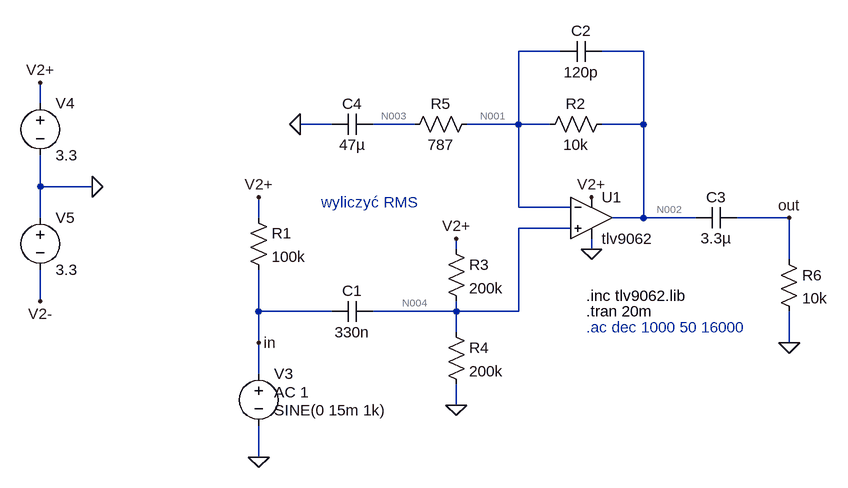
[diagram p0: schematic microphone_ampilier.asc]
microphone_ampilier.asc, the LTspice schematic file:
Version 4.1
SHEET 1 1596 680
WIRE 368 -16 304 -16
WIRE 496 -16 432 -16
WIRE -432 64 -432 32
WIRE 16 96 -32 96
WIRE 144 96 80 96
WIRE 304 96 304 -16
WIRE 304 96 224 96
WIRE 352 96 304 96
WIRE 496 96 496 -16
WIRE 496 96 432 96
WIRE -432 192 -432 144
WIRE -352 192 -432 192
WIRE 304 224 304 96
WIRE 384 224 304 224
WIRE -432 240 -432 192
WIRE -96 240 -96 208
WIRE 496 240 496 96
WIRE 496 240 448 240
WIRE 576 240 496 240
WIRE 720 240 640 240
WIRE 384 256 304 256
WIRE 208 288 208 272
WIRE 416 288 416 272
WIRE 720 304 720 240
WIRE -432 368 -432 320
WIRE -96 384 -96 320
WIRE 16 384 -96 384
WIRE 208 384 208 368
WIRE 208 384 80 384
WIRE 304 384 304 256
WIRE 304 384 208 384
WIRE 208 416 208 384
WIRE -96 432 -96 384
WIRE 720 432 720 384
WIRE -96 480 -96 432
WIRE 208 528 208 496
WIRE -96 608 -96 560
FLAG -96 608 0
FLAG -96 208 V2+
FLAG -352 192 0
FLAG -432 32 V2+
FLAG -432 368 V2-
FLAG 208 272 V2+
FLAG 208 528 0
FLAG 720 240 out
FLAG -96 432 in
FLAG -32 96 0
FLAG 416 208 V2+
FLAG 416 288 0
FLAG 720 432 0
SYMBOL OpAmps\\opamp2 416 176 R0
SYMATTR InstName U1
SYMATTR Value tlv9062
SYMBOL voltage -96 464 R0
WINDOW 123 24 44 Left 2
WINDOW 39 0 0 Left 0
WINDOW 3 24 72 Left 2
SYMATTR Value2 AC 1
SYMATTR InstName V3
SYMATTR Value SINE(0 15m 1k)
SYMBOL res -112 224 R0
SYMATTR InstName R1
SYMATTR Value 100k
SYMBOL cap 80 368 R90
WINDOW 0 0 32 VBottom 2
WINDOW 3 32 32 VTop 2
SYMATTR InstName C1
SYMATTR Value 330n
SYMBOL res 448 80 R90
WINDOW 0 0 56 VBottom 2
WINDOW 3 32 56 VTop 2
SYMATTR InstName R2
SYMATTR Value 10k
SYMBOL cap 432 -32 R90
WINDOW 0 0 32 VBottom 2
WINDOW 3 32 32 VTop 2
SYMATTR InstName C2
SYMATTR Value 120p
SYMBOL res 192 272 R0
SYMATTR InstName R3
SYMATTR Value 200k
SYMBOL voltage -432 48 R0
WINDOW 123 0 0 Left 0
WINDOW 39 0 0 Left 0
SYMATTR InstName V4
SYMATTR Value 3.3
SYMBOL voltage -432 224 R0
WINDOW 123 0 0 Left 0
WINDOW 39 0 0 Left 0
SYMATTR InstName V5
SYMATTR Value 3.3
SYMBOL res 192 400 R0
SYMATTR InstName R4
SYMATTR Value 200k
SYMBOL cap 16 112 R270
WINDOW 0 32 32 VTop 2
WINDOW 3 0 32 VBottom 2
SYMATTR InstName C4
SYMATTR Value 47µ
SYMBOL res 240 80 R90
WINDOW 0 0 56 VBottom 2
WINDOW 3 32 56 VTop 2
SYMATTR InstName R5
SYMATTR Value 787
SYMBOL cap 576 256 R270
WINDOW 0 32 32 VTop 2
WINDOW 3 0 32 VBottom 2
SYMATTR InstName C3
SYMATTR Value 3.3µ
SYMBOL res 704 288 R0
SYMATTR InstName R6
SYMATTR Value 10k
TEXT 408 360 Left 2 !.inc tlv9062.lib
TEXT 408 384 Left 2 !.tran 20m
TEXT 0 216 Left 2 ;wyliczyć RMS
TEXT 408 408 Left 2 ;.ac dec 1000 50 16000

The netlist it stands for:
* microphone_ampilier.asc
X§U1 N004 N001 V2+ 0 N002 tlv9062  ; pins In+ In- V+ V- OUT
V3 in 0 SINE(0 15m 1k) AC 1
R1 V2+ in 100k
C1 N004 in 330n
R2 N002 N001 10k
C2 N002 N001 120p
R3 V2+ N004 200k
V4 V2+ 0 3.3
V5 0 V2- 3.3
R4 N004 0 200k
C4 0 N003 47µ
R5 N001 N003 787
C3 N002 out 3.3µ
R6 out 0 10k
.inc tlv9062.lib
.tran 20m
* wyliczyć RMS
* .ac dec 1000 50 16000
.backanno
.end

* Results of the author's LTspice run, read from the files saved beside the schematic
* Operating Point, zero values left out:
*   V(n001) = 1.65 V
*   V(n002) = 1.65 V
*   V(n003) = 1.65 V
*   V(n004) = 1.65 V
*   V(v2+) = 3.3 V
*   V(v2-) = -3.3 V
*   I(R4) = 8.25 µA
*   I(R1) = 33 µA
*   I(V4) = -579.2 µA
*   I(R3) = 8.25 µA
*   I(V3) = 33 µA
*   Ix(u1:vcc) = 538 µA
*   Ix(u1:vee) = -538 µA
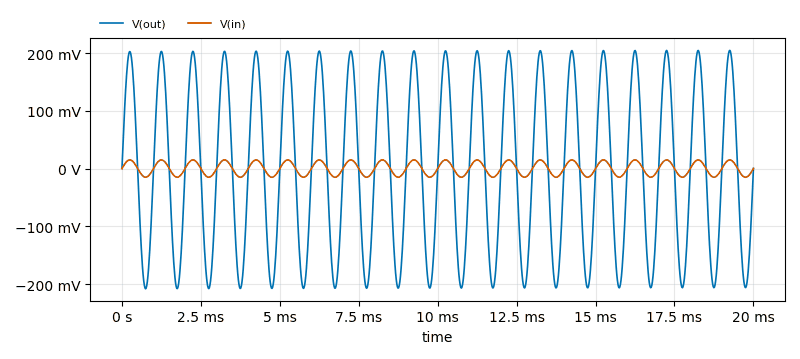
[diagram p1: Transient Analysis of microphone_ampilier.asc, plotted from the saved traces]
* Transient Analysis, 1 run:
*   V(out): min -208.3 mV, max 204.8 mV, average -1.606 mV, rms 145.4 mV, last 321.5 µV
*   V(in): min -15 mV, max 15 mV, average 18.33 nV, rms 10.61 mV, last 0 V